# Altium project FOC_DRV8323.PrjPcb
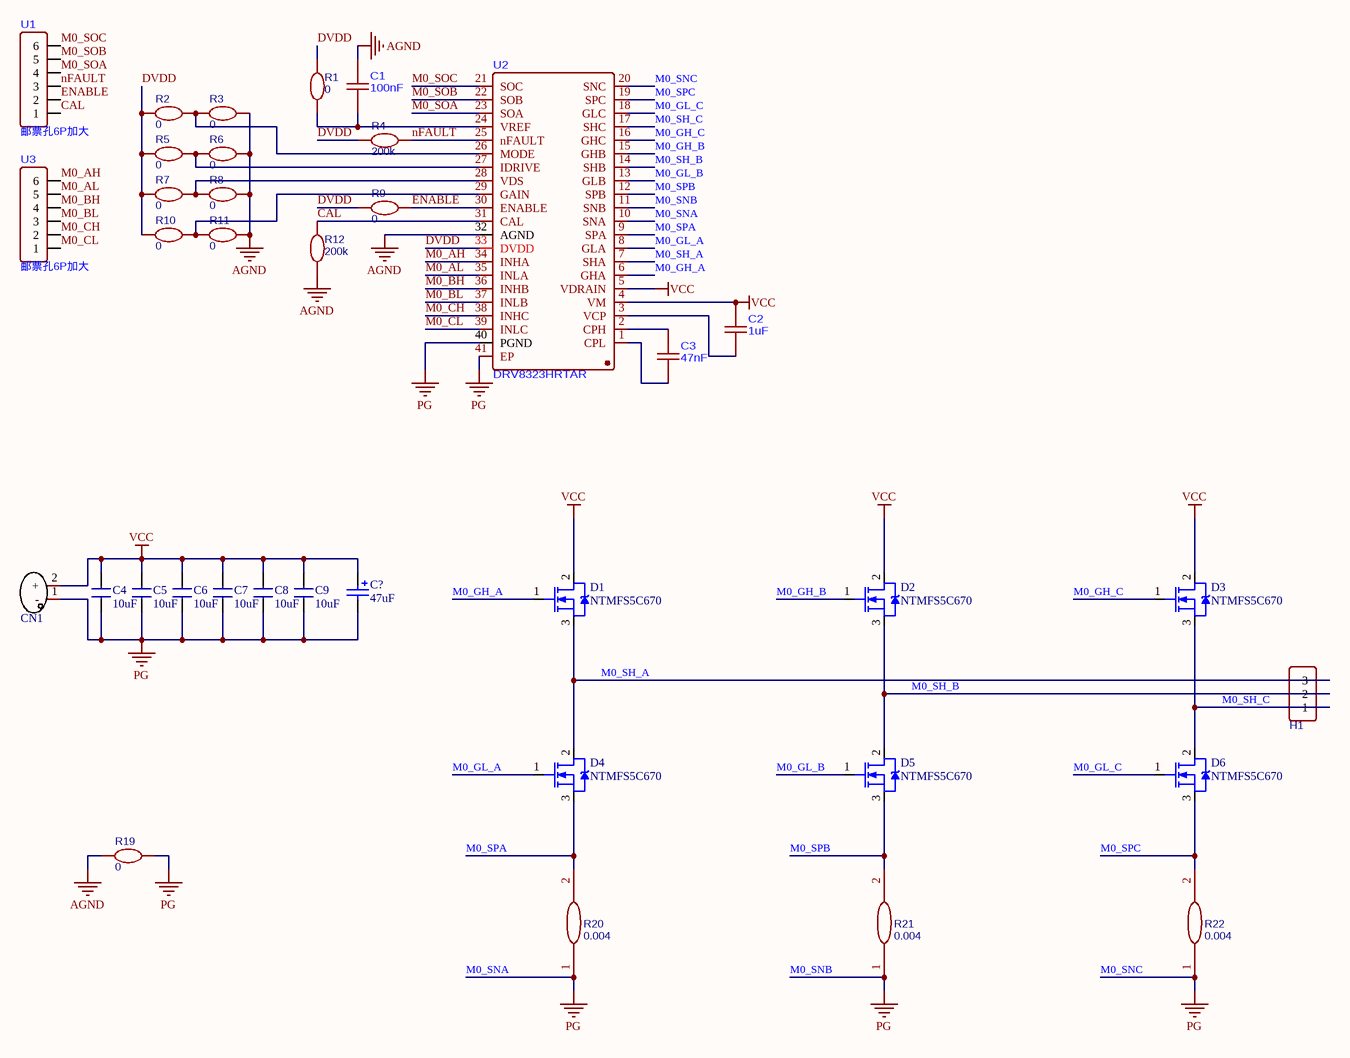
[diagram p0: FOC_DRV8323.SchDoc]
1 sheet, 37 parts. Net scope: global (net labels, ports and power ports of the same name join across sheets).
Board file: FOC_DRV8323.PcbDoc

## Sheet FOC_DRV8323.SchDoc
size A2; SheetNumber: 1; SheetTotal: 1

### Parts
C1  100nF  [c0402]
C2  1uF  [C0603]
C3  47nF  [C0603]
C4  10uF  [1210]
C5  10uF  [1210]
C6  10uF  [1210]
C7  10uF  [C0805]
C8  10uF  [C0805]
C9  10uF  [C0805]
C?  value 47uF  [C10X10]  (hidden comment: 铝电解电容)
CN1  XT30_1  [XT30卧式焊盘]  (value not drawn)
D1  NTMFS5C670  [pg-tdson-8]
D2  NTMFS5C670  [pg-tdson-8]
D3  NTMFS5C670  [pg-tdson-8]
D4  NTMFS5C670  [pg-tdson-8]
D5  NTMFS5C670  [pg-tdson-8]
D6  NTMFS5C670  [pg-tdson-8]
H1  MR30-M  [MR30]  (value not drawn)
R1  0  [R0402]
R2  0  [R0402]
R3  0  [R0402]
R4  200k  [R0402]
R5  0  [R0402]
R6  0  [R0402]
R7  0  [R0402]
R8  0  [R0402]
R9  0  [R0402]
R10  0  [R0402]
R11  0  [R0402]
R12  200k  [R0402]
R19  0  [R0402]
R20  0.004  [R2512]
R21  0.004  [R2512]
R22  0.004  [R2512]
U1  邮票孔6P加大  [PCBComponent_1___pad]
U2  DRV8323HRTAR  [QFN-40_L6.0-W6.0-P0.50-BL-EP4.5]
U3  邮票孔6P加大  [PCBComponent_1___pad]

### Nets
AGND: C1.2 R3.1 R6.1 R8.1 R11.1 R12.2 R19.1 U2.32(AGND)
M0_SNA: C4.1 C5.1 C6.1 C7.1 C8.1 C9.1 C?.2 CN1.1(-) R19.2 R20.1 R21.1 R22.1 U2.10(SNA) U2.11(SNB) U2.20(SNC) U2.40(PGND) U2.41(EP)  [also labelled M0_SNB, M0_SNC, PG]
VCC: C2.2 C4.2 C5.2 C6.2 C7.2 C8.2 C9.2 C?.1 CN1.2(+) D1.2(D) D2.2(D) D3.2(D) U2.4(VM) U2.5(VDRAIN)
CAL: R12.1 U1.6(1) U2.31(CAL)
DVDD: R1.1 R2.2 R4.1 R5.2 R7.2 R9.2 R10.2 U2.33(DVDD)
ENABLE: R9.1 U1.5(2) U2.30(ENABLE)
M0_AH: U2.34(INHA) U3.1(6)
M0_AL: U2.35(INLA) U3.2(5)
M0_BH: U2.36(INHB) U3.3(4)
M0_BL: U2.37(INLB) U3.4(3)
M0_CH: U2.38(INHC) U3.5(2)
M0_CL: U2.39(INLC) U3.6(1)
M0_GH_A: D1.1(G) U2.6(GHA)
M0_GH_B: D2.1(G) U2.15(GHB)
M0_GH_C: D3.1(G) U2.16(GHC)
M0_GL_A: D4.1(G) U2.8(GLA)
M0_GL_B: D5.1(G) U2.13(GLB)
M0_GL_C: D6.1(G) U2.18(GLC)
M0_SH_A: D1.3(S) D4.2(D) H1.3 U2.7(SHA)
M0_SH_B: D2.3(S) D5.2(D) H1.2 U2.14(SHB)
M0_SH_C: D3.3(S) D6.2(D) H1.1 U2.17(SHC)
M0_SOA: U1.3(4) U2.23(SOA)
M0_SOB: U1.2(5) U2.22(SOB)
M0_SOC: U1.1(6) U2.21(SOC)
M0_SPA: D4.3(S) R20.2 U2.9(SPA)
M0_SPB: D5.3(S) R21.2 U2.12(SPB)
M0_SPC: D6.3(S) R22.2 U2.19(SPC)
nFAULT: R4.2 U1.4(3) U2.25(nFAULT)
NetC1_1: C1.1 R1.2 U2.24(VREF)
NetC2_1: C2.1 U2.3(VCP)
NetC3_1: C3.1 U2.1(CPL)
NetC3_2: C3.2 U2.2(CPH)
NetR2_1: R2.1 R3.2 U2.26(MODE)
NetR5_1: R5.1 R6.2 U2.27(IDRIVE)
NetR7_1: R7.1 R8.2 U2.28(VDS)
NetR10_1: R10.1 R11.2 U2.29(GAIN)

### Library data of the parts
C1-C3 = CC0201JRX7R9BB101
C4-C9 = 1210贴片电容
C? = SMD 10x10 铝电解电容: Published: 8-Jun-2000; LatestRevisionDate: 29-May-2009; LatestRevisionNote: IPC-7351 Footprint Added.; PackageReference: C0805; Publisher: Altium Limited; PackageDescription: Chip Capacitor
D1-D6 = NTMFS5C670: N沟道MOS管; Note: Pin 2 is electrically connected to pin 4.; Published: 8-Jun-2000; LatestRevisionDate: 17-Jul-2002; LatestRevisionNote: Re-released for DXP Platform.; DatasheetVersion: PD-9.814; PackageVersion: Feb-1997; PackageReference: TO-220AB; Publisher: Altium Limited; PackageDescription: TO, Thru-Hole, Vertical, Heatsink Mounted; 3 In-Line Leads; Pitch 2.54 mm; ComponentLink1Description: Manufacturer Link; ComponentLink1URL: http://www.irf.com/
H1 = MR30-M: BOM_Manufacturer: AMASS(艾迈斯); Contributor: LCEDA_Lib; BOM_Supplier Part: C99873; BOM_Supplier: LCSC; BOM_Manufacturer Part: MR30-M; spicePre: H; spiceSymbolName: HDR-F-2.54_1x3
R1-R12 R19 = 2.2R: BOM_Manufacturer Part: 0603WAJ022JT5E; BOM_Manufacturer: UniOhm; nameAlias: Value(Ω); spicePre: R; spiceSymbolName: Res_0603(1/10W)_EU; BOM_Supplier: LCSC; BOM_Supplier Part: C25226
R20-R22 = 0.0005: BOM_Manufacturer: RALEC(旺诠); BOM_Manufacturer Part: LR2512-23R0005J4; nameAlias: Resistance (Ohms); Contributor: LCSC; BOM_Supplier: LCSC; BOM_Supplier Part: C2681067; spicePre: R; spiceSymbolName: LCSR2512FL500K9L
U1 U3 = 邮票孔6P加大: System: Connector